# Altium schematic sheet ngh-power.SchDoc
size A4
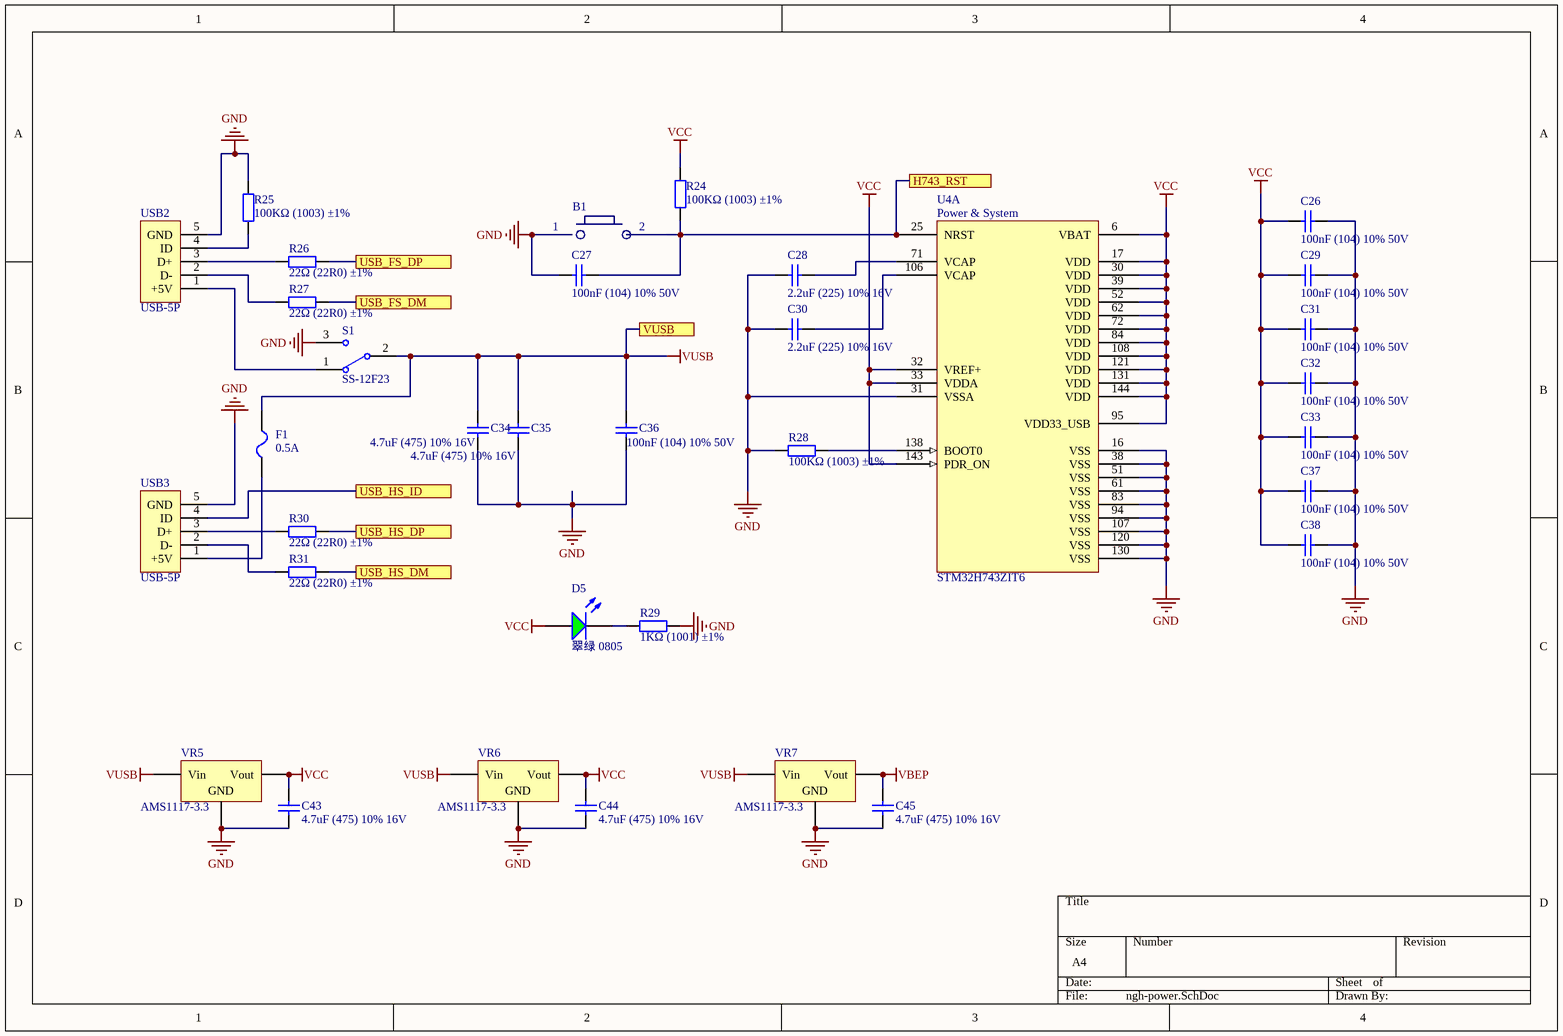
[diagram p0: ngh-power.SchDoc]

## Parts
B1  B1  [MetalButton]  (value not drawn)
C26  100nF (104) 10% 50V  [0603_C]
C27  100nF (104) 10% 50V  [0603_C]
C28  2.2uF (225) 10% 16V  [0603_C]
C29  100nF (104) 10% 50V  [0603_C]
C30  2.2uF (225) 10% 16V  [0603_C]
C31  100nF (104) 10% 50V  [0603_C]
C32  100nF (104) 10% 50V  [0603_C]
C33  100nF (104) 10% 50V  [0603_C]
C34  4.7uF (475) 10% 16V  [0603_C]
C35  4.7uF (475) 10% 16V  [0603_C]
C36  100nF (104) 10% 50V  [0603_C]
C37  100nF (104) 10% 50V  [0603_C]
C38  100nF (104) 10% 50V  [0603_C]
C43  4.7uF (475) 10% 16V  [0603_C]
C44  4.7uF (475) 10% 16V  [0603_C]
C45  4.7uF (475) 10% 16V  [0603_C]
D5  翠绿 0805  [0805_LED_S1]
F1  0.5A  [FU 0603]
R24  100KΩ (1003) ±1%  [0603_R]
R25  100KΩ (1003) ±1%  [0603_R]
R26  22Ω (22R0) ±1%  [0603_R]
R27  22Ω (22R0) ±1%  [0603_R]
R28  100KΩ (1003) ±1%  [0603_R]
R29  1KΩ (1001) ±1%  [0603_R]
R30  22Ω (22R0) ±1%  [0603_R]
R31  22Ω (22R0) ±1%  [0603_R]
S1  SS-12F23  [SS-12F23]
U4  STM32H743ZIT6  [LQFP-144_20x20]  (part A of 6)
USB2  USB-5P  [USB-MICRO_D]
USB3  USB-5P  [USB-MICRO_D]
VR5  AMS1117-3.3  [SOT-223]
VR6  AMS1117-3.3  [SOT-223]
VR7  AMS1117-3.3  [SOT-223]

## Ports
H743_RST, USB_FS_DM, USB_FS_DP, USB_HS_DM, USB_HS_DP, USB_HS_ID, VUSB

## Nets
GND: B1.1 C26.1 C27.1 C28.1 C29.1 C30.1 C31.1 C32.1 C33.1 C34.1 C35.1 C36.1 C37.1 C38.1 C43.1 C44.1 C45.1 R25.2 R28.2 R29.1 S1.3 U4.16(VSS) U4.31(VSSA) U4.38(VSS) U4.51(VSS) U4.61(VSS) U4.83(VSS) U4.94(VSS) U4.107(VSS) U4.120(VSS) U4.130(VSS) USB2.5(GND) USB3.5(GND) VR5.1(GND) VR6.1(GND) VR7.1(GND)
VBEP: C45.2 VR7.2(Vout)
VCC: C26.2 C29.2 C31.2 C32.2 C33.2 C37.2 C38.2 C43.2 C44.2 D5.A R24.2 U4.6(VBAT) U4.17(VDD) U4.30(VDD) U4.32(VREF+) U4.33(VDDA) U4.39(VDD) U4.52(VDD) U4.62(VDD) U4.72(VDD) U4.84(VDD) U4.95(VDD33_USB) U4.108(VDD) U4.121(VDD) U4.131(VDD) U4.143(PDR_ON) U4.144(VDD) VR5.2(Vout) VR6.2(Vout)
VUSB: C34.2 C35.2 C36.2 F1.2 S1.2 VR5.3(Vin) VR6.3(Vin) VR7.3(Vin) ; port VUSB
H743_RST: B1.2 C27.2 R24.1 U4.25(NRST) ; port H743_RST
USB_FS_DM: R27.2 ; port USB_FS_DM
USB_FS_DP: R26.2 ; port USB_FS_DP
USB_HS_DM: R31.2 ; port USB_HS_DM
USB_HS_DP: R30.2 ; port USB_HS_DP
USB_HS_ID: USB3.4(ID) ; port USB_HS_ID
NetC28_2: C28.2 U4.71(VCAP)
NetC30_2: C30.2 U4.106(VCAP)
NetD5_K: D5.K R29.2
NetF1_1: F1.1 USB3.1(+5V)
NetR25_1: R25.1 USB2.4(ID)
NetR26_1: R26.1 USB2.3(D+)
NetR27_1: R27.1 USB2.2(D-)
NetR28_1: R28.1 U4.138(BOOT0)
NetR30_1: R30.1 USB3.3(D+)
NetR31_1: R31.1 USB3.2(D-)
NetS1_1: S1.1 USB2.1(+5V)

## Notes on the sheet
- (in symbol STM32H743ZIT6, part A) Power & System

## Library data of the parts
B1 = MetalButton
C26 C27 C29 C31-C33 C36-C38 = 0603 100nF (104) 10% 50V: 贴片电容; ComponentLink1Description: 供应商链接; ComponentLink1URL: http://www.szlcsc.com/product/details_15331.html; Package: 0603; Supplier: LC; SuppliersPartNumber: C14663
C28 C30 = 0603 2.2uF (225) 10% 16V: 贴片电容; ComponentLink1Description: 供应商链接; ComponentLink1URL: http://www.szlcsc.com/product/details_24366.html; Package: 0603; Supplier: LC; SuppliersPartNumber: C23630
C34 C35 C43-C45 = 0603 4.7uF (475) 10% 16V: 贴片电容; ComponentLink1Description: 供应商链接; ComponentLink1URL: http://www.szlcsc.com/product/details_20375.html; Package: 0603; Supplier: LC; SuppliersPartNumber: C19666
D5 = 0805 翠绿: 发光二极管; ComponentLink1Description: 供应商链接; ComponentLink1URL: http://www.szlcsc.com/product/details_2670.html; Package: 0805; Supplier: LC; SuppliersPartNumber: C2297
F1 = FU: 贴片保险丝; 版权归属: 源创客; BOM名称: 贴片保险丝; 学习资源: www.ooocke.com
R24 R25 R28 = 0603 100KΩ (1003) 1%: 贴片电阻; ComponentLink1Description: 供应商链接; ComponentLink1URL: http://www.szlcsc.com/product/details_26546.html; Package: 0603; Supplier: LC; SuppliersPartNumber: C25803
R26 R27 R30 R31 = 0603 22Ω (22R0) 1%: 贴片电阻; ComponentLink1Description: 供应商链接; ComponentLink1URL: http://www.szlcsc.com/product/details_24078.html; Package: 0603; Supplier: LC; SuppliersPartNumber: C23345
R29 = 0603 1KΩ (1001) 1%: 贴片电阻; ComponentLink1Description: 供应商链接; ComponentLink1URL: http://www.szlcsc.com/product/details_21904.html; Package: 0603; Supplier: LC; SuppliersPartNumber: C21190
S1 = SSW-1P: 1路波动开关; BOM名称: 波动开关; 版权归属: 源创客; 学习资源: www.ooocke.com
USB2 USB3 = USB-5P: 微型USB母座; 版权归属: 源创客; BOM名称: 微型USB母座; 学习资源: www.ooocke.com
VR5-VR7 = SOT-223 AMS1117-3.3: 低压差线性稳压(LDO); ComponentLink1Description: 供应商链接; ComponentLink1URL: http://www.szlcsc.com/product/details_6652.html; Package: SOT-223; Supplier: LC; SuppliersPartNumber: C6186